# Altium schematic sheet Connectors.SchDoc
size 420 x 297 mm; Revision: 1.1.0; SheetNumber: 2; SheetTotal: 15
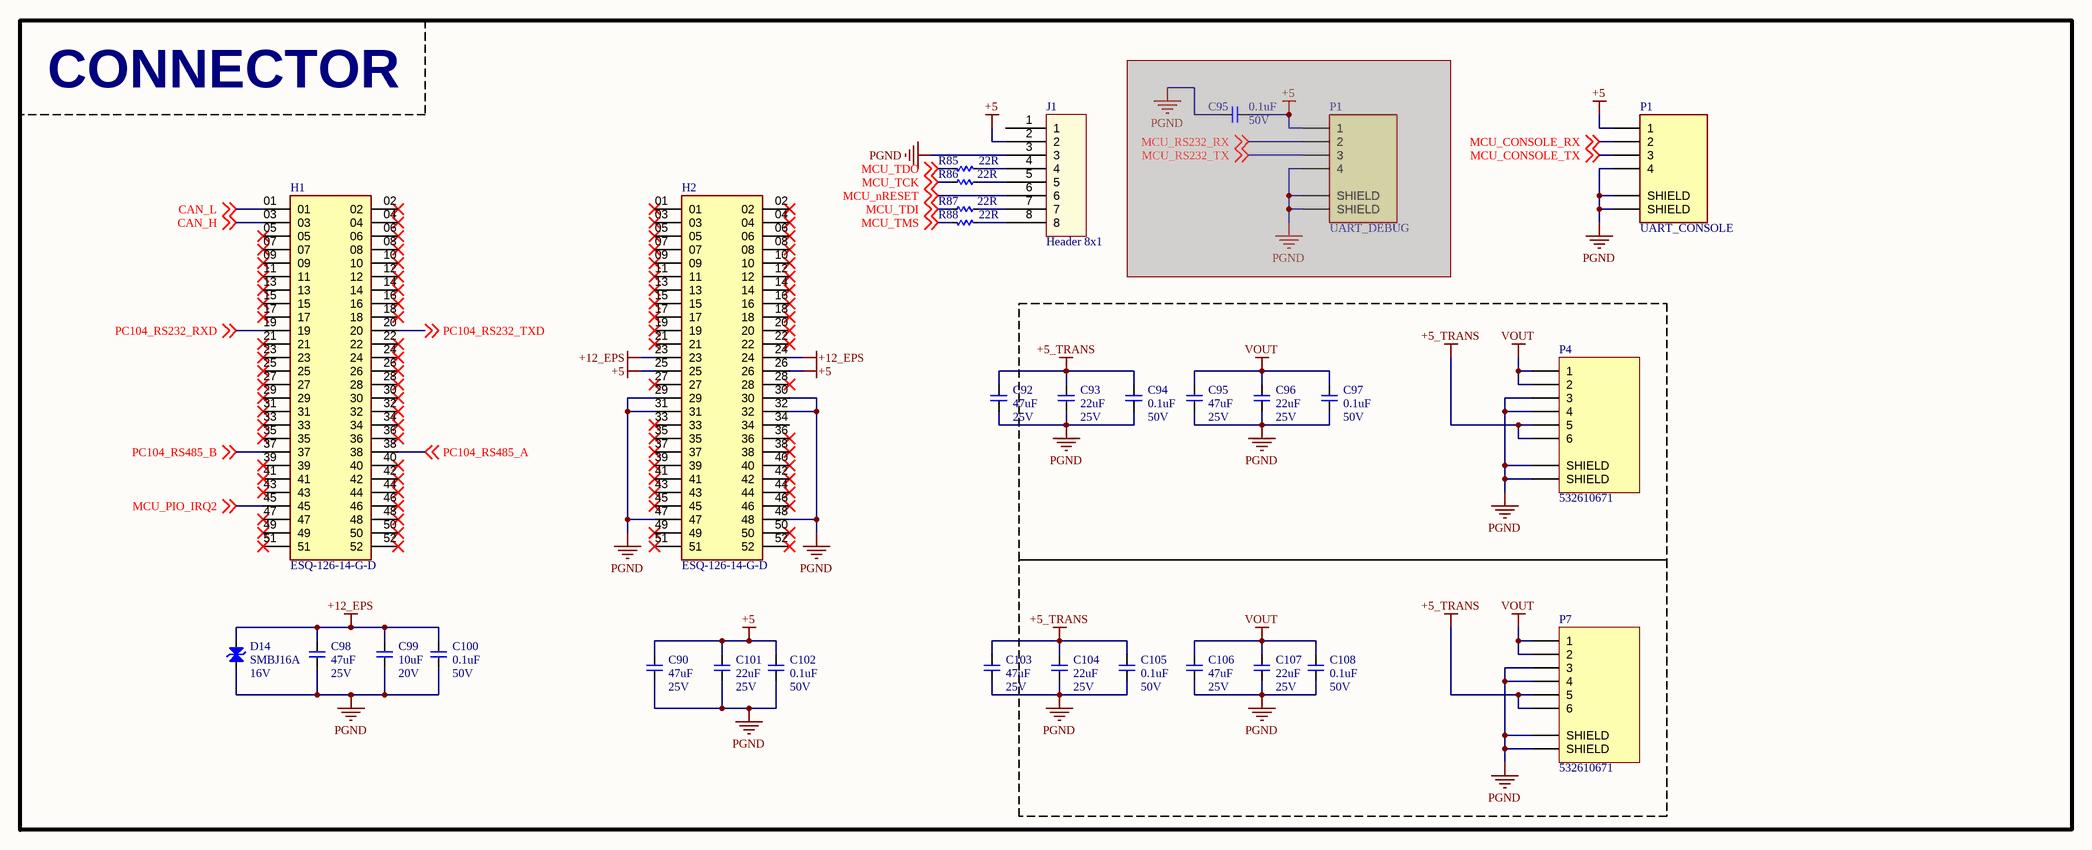
[diagram p0: Connectors.SchDoc]

## Parts
(Parts that share a designator on the sheet are numbered #1, #2 ... from top to bottom, then left to right.)
C90  47uF  Voltage: 25V  [CAP_C_3225X80]
C92  47uF  Voltage: 25V  [CAP_C_3225X80]
C93  22uF  Voltage: 25V  [CAP_C_2012X110]
C94  0.1uF  Voltage: 50V  [CAP_C_1608X80]
C95#1  0.1uF  Voltage: 50V  [CAP_C_1608X80]  (masked out: inside a compile mask, not in the netlist)
C95#2  47uF  Voltage: 25V  [CAP_C_3225X80]
C96  22uF  Voltage: 25V  [CAP_C_2012X110]
C97  0.1uF  Voltage: 50V  [CAP_C_1608X80]
C98  47uF  Voltage: 25V  [CAP_C_3225X80]
C99  10uF  Voltage: 20V  [CAP_C_2012X110]
C100  0.1uF  Voltage: 50V  [CAP_C_1608X80]
C101  22uF  Voltage: 25V  [CAP_C_2012X110]
C102  0.1uF  Voltage: 50V  [CAP_C_1608X80]
C103  47uF  Voltage: 25V  [CAP_C_3225X80]
C104  22uF  Voltage: 25V  [CAP_C_2012X110]
C105  0.1uF  Voltage: 50V  [CAP_C_1608X80]
C106  47uF  Voltage: 25V  [CAP_C_3225X80]
C107  22uF  Voltage: 25V  [CAP_C_2012X110]
C108  0.1uF  Voltage: 50V  [CAP_C_1608X80]
D14  SMBJ16A  Voltage: 16V  [DO-214AA_SMB]
H1  ESQ-126-14-G-D  [ESQ-126-14-G-D]
H2  ESQ-126-14-G-D  [ESQ-126-14-G-D]
J1  Header 8x1  [Header_254P_8x1]
P1#1  UART_DEBUG  [0532610471]  (masked out: inside a compile mask, not in the netlist)
P1#2  UART_CONSOLE  [0532610471]
P4  532610671  [532610671]
P7  532610671  [532610671]
R85  22R  [RES_C_1608X60]
R86  22R  [RES_C_1608X60]
R87  22R  [RES_C_1608X60]
R88  22R  [RES_C_1608X60]

## Blocks framed on the sheet
CONNECTOR: C90 C92-C94 C95#1 C95#2 C96-C108 D14 H1 H2 J1 P1#1 P1#2 P4 P7 R85-R88

## Nets
+5: C90.2 C101.2 C102.2 H2.25 H2.26 J1.2 P1#2.1
+5_TRANS: C92.2 C93.2 C94.2 C103.2 C104.2 C105.2 P4.5 P4.6 P7.5 P7.6
+12_EPS: C98.2 C99.2 C100.2 D14.1(A) H2.23 H2.24
PGND: C90.1 C92.1 C93.1 C94.1 C95#2.1 C96.1 C97.1 C98.1 C99.1 C100.1 C101.1 C102.1 C103.1 C104.1 C105.1 C106.1 C107.1 C108.1 D14.2(K) H2.29 H2.30 H2.31 H2.32 H2.47 H2.48 J1.3 P1#2.4 P1#2.S1(SHIELD) P1#2.S2(SHIELD) P4.3 P4.4 P4.S1(SHIELD) P4.S2(SHIELD) P7.3 P7.4 P7.S1(SHIELD) P7.S2(SHIELD)
VOUT: C95#2.2 C96.2 C97.2 C106.2 C107.2 C108.2 P4.1 P4.2 P7.1 P7.2
CAN_H: H1.03 ; off-sheet CAN_H
CAN_L: H1.01 ; off-sheet CAN_L
MCU_CONSOLE_RX: P1#2.2 ; off-sheet MCU_CONSOLE_RX
MCU_CONSOLE_TX: P1#2.3 ; off-sheet MCU_CONSOLE_TX
MCU_nRESET: J1.6 ; off-sheet MCU_nRESET
MCU_PIO_IRQ2: H1.45 ; off-sheet MCU_PIO_IRQ2
MCU_TCK: R86.1 ; off-sheet MCU_TCK
MCU_TDI: R87.1 ; off-sheet MCU_TDI
MCU_TDO: R85.2 ; off-sheet MCU_TDO
MCU_TMS: R88.1 ; off-sheet MCU_TMS
PC104_RS232_RXD: H1.19 ; off-sheet PC104_RS232_RXD
PC104_RS232_TXD: H1.20 ; off-sheet PC104_RS232_TXD
PC104_RS485_A: H1.38 ; off-sheet PC104_RS485_A
PC104_RS485_B: H1.37 ; off-sheet PC104_RS485_B
NetJ1_4: J1.4 R85.1
NetJ1_5: J1.5 R86.2
NetJ1_7: J1.7 R87.2
NetJ1_8: J1.8 R88.2

Not connected (* = marked no-connect by the designer): H1 02* 04* 05* 06* 07* 08* 09* 10* 11* 12* 13* 14* 15* 16* 17* 18* 21* 22* 23* 24* 25* 26* 27* 28* 29* 30* 31* 32* 33* 34* 35* 36* 39* 40* 41* 42* 43* 44* 46* 47* 48* 49* 50* 51* 52*; H2 01* 02* 03* 04* 05* 06* 07* 08* 09* 10* 11* 12* 13* 14* 15* 16* 17* 18* 19* 20* 21* 22* 27* 28* 33* 34 35* 36* 37* 38* 39* 40* 41* 42* 43* 44* 45* 46* 49* 50* 51* 52*; J1 1

## Notes on the sheet
- Project:
- DAL_PDU
- Sub-system:
- IGRVT-50
- Design by:
- KIEN HOANG
- BAO BUI
- Sheet title:
- Sheet
- A3
- of
- Checked by:
- Approved by:
- VU PHAM
- Revision:
- Document No:
- Size:
- Date:

## Library data of the parts
C90 C92-C94 C95#1 C95#2 C96-C108 = _CAP_C_2: CAP
D14 = Diode TVS: TVS Diode; Code - JEDEC: DO-214-AB; Value: 1N5007; Published: 8-Jun-2000; Revision: July-2002: Re-released for DXP Platform.; Publisher: Altium Limited
P1#1 P1#2 = 0532610471
R85-R88 = _RES_B_2_2: RES